# Altium project IOBoard2020.PrjPcb (part 2 of 3)

## Sheet Interlock.SchDoc
size A3
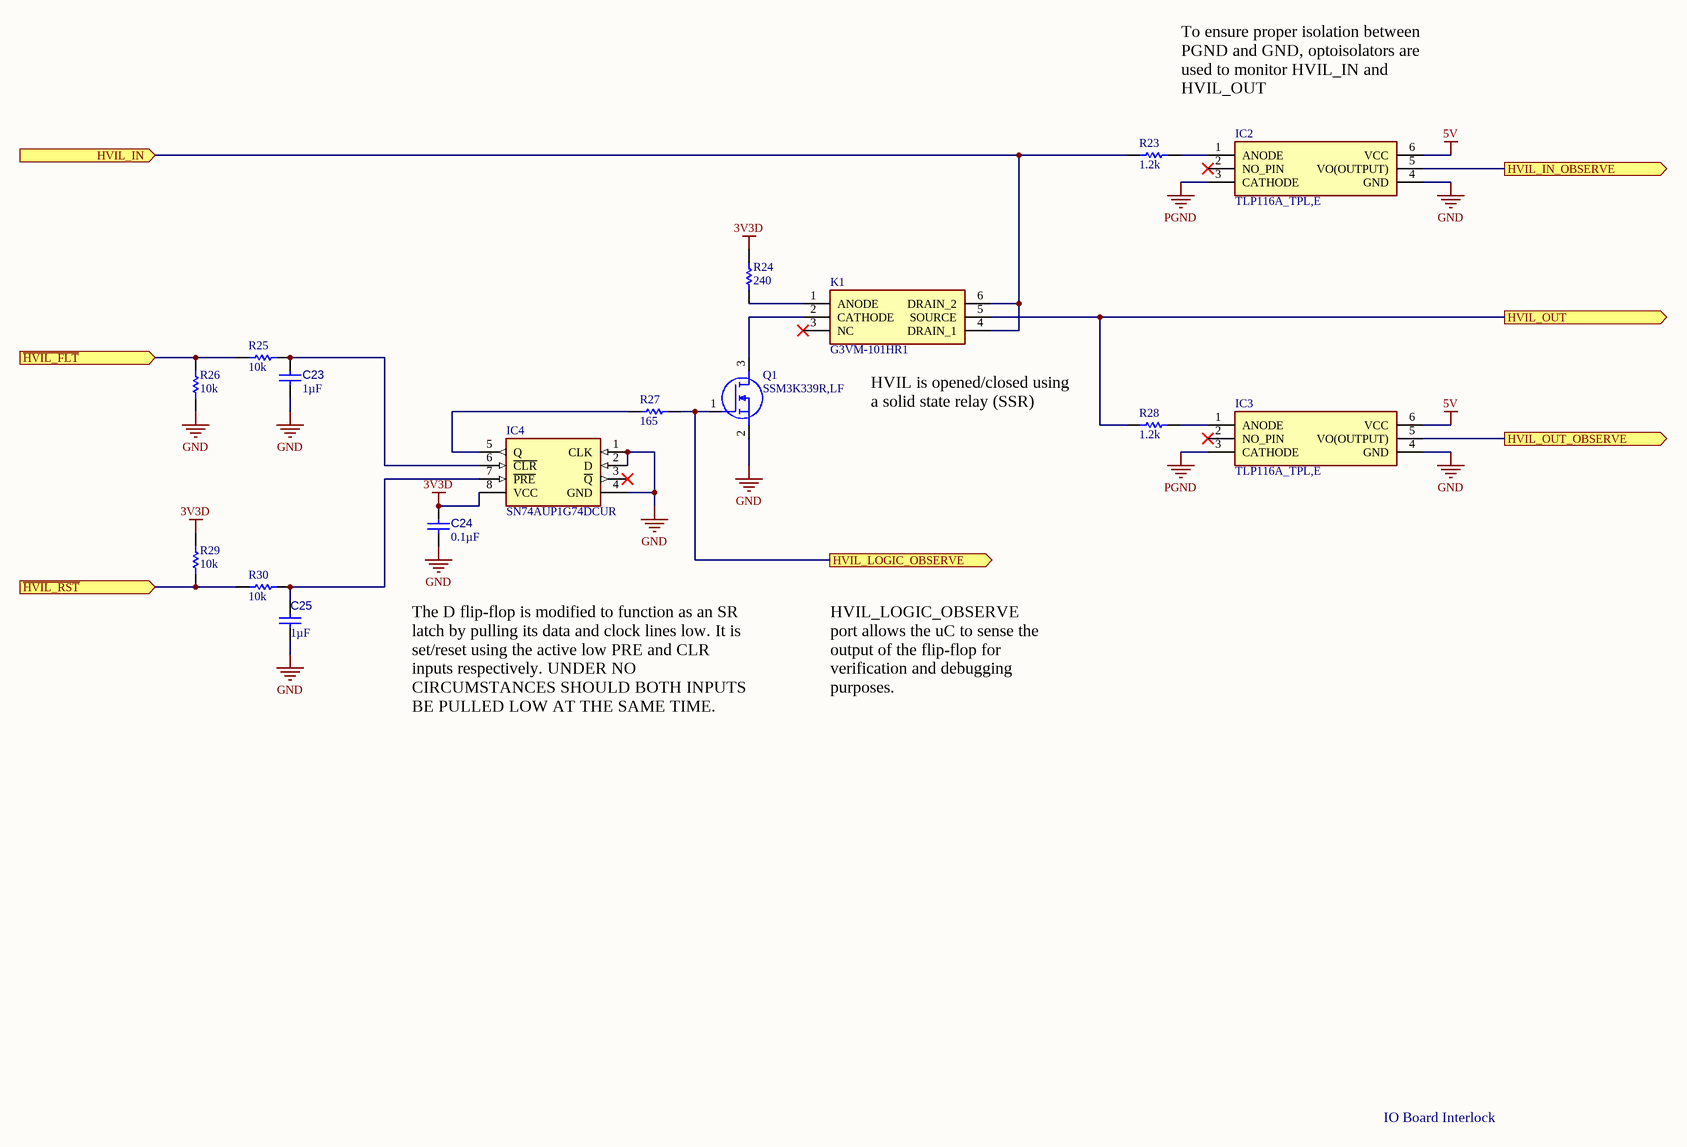
[diagram p3: Interlock.SchDoc]

### Parts
C23  1µF  [CAPC2013X145X50ML20T25]
C24  0.1µF  [CAPC2013X145X50ML20T25]
C25  1µF  [CAPC2013X145X50ML20T25]
IC2  TLP116A_TPL,E  [SOT127P700X230-6N]
IC3  TLP116A_TPL,E  [SOT127P700X230-6N]
IC4  SN74AUP1G74DCUR  [SOT50P310X90-8N]
K1  G3VM-101HR1  [G3VM101HR1]
Q1  SSM3K339R,LF  [SOTFL95P240X88-3N]
R23  1.2k  [RESC2013X50X35ML15T15]
R24  240  [RESC2013X50X35ML15T15]
R25  10k  [RESC2013X50X35ML15T15]
R26  10k  [RESC2013X50X35ML15T15]
R27  165  [RESC2013X50X35ML15T15]
R28  1.2k  [RESC2013X50X35ML15T15]
R29  10k  [RESC2013X50X35ML15T15]
R30  10k  [RESC2013X50X35ML15T15]

### Ports
HVIL_IN (in), HVIL_IN_OBSERVE (out), HVIL_LOGIC_OBSERVE (out), HVIL_OUT (out), HVIL_OUT_OBSERVE (out), ~{HVIL_FLT} (in), ~{HVIL_RST} (in)

### Nets
3V3D: C24.2 IC4.8(VCC) R24.1 R29.2
5V: IC2.6(VCC) IC3.6(VCC)
GND: C23.2 C24.1 C25.1 IC2.4(GND) IC3.4(GND) IC4.1(CLK) IC4.2(D) IC4.4(GND) Q1.2(S) R26.1
PGND: IC2.3(CATHODE) IC3.3(CATHODE)
NetC23_1: C23.1 IC4.6(~{CLR}) R25.1
NetC25_2: C25.2 IC4.7(~{PRE}) R30.1
NetIC1_92: Q1.1(G) R27.2 ; port HVIL_LOGIC_OBSERVE
NetIC1_93: IC2.5(VO(OUTPUT)) ; port HVIL_IN_OBSERVE
NetIC1_94: IC3.5(VO(OUTPUT)) ; port HVIL_OUT_OBSERVE
NetIC1_95: R25.2 R26.2 ; port ~{HVIL_FLT}
NetIC1_96: R29.1 R30.2 ; port ~{HVIL_RST}
NetIC2_1: IC2.1(ANODE) R23.2
NetIC3_1: IC3.1(ANODE) R28.2
NetIC4_5: IC4.5(Q) R27.1
NetJ5_1: K1.5(SOURCE) R28.1 ; port HVIL_OUT
NetJ5_2: K1.4(DRAIN_1) K1.6(DRAIN_2) R23.1 ; port HVIL_IN
NetK1_1: K1.1(ANODE) R24.2
NetK1_2: K1.2(CATHODE) Q1.3(D)

Not connected (* = marked no-connect by the designer): IC2 2(NO_PIN)*; IC3 2(NO_PIN)*; IC4 3(~{Q})*; K1 3(NC)*

### Notes on the sheet
- To ensure proper isolation between PGND and GND, optoisolators are used to monitor HVIL_IN and HVIL_OUT
- (near K1) HVIL is opened/closed using a solid state relay (SSR)
- The D flip-flop is modified to function as an SR latch by pulling its data and clock lines low. It is set/reset using the active low PRE and CLR inputs respectively. UNDER NO CIRCUMSTANCES SHOULD BOTH INPUTS BE PULLED LOW AT THE SAME TIME.
- HVIL_LOGIC_OBSERVE port allows the uC to sense the output of the flip-flop for verification and debugging purposes.
- IO Board Interlock

### Library data of the parts
C23 C25 = CMP-001-00010-4: Chip Capacitor, 1 uF, +/-10%, 25 V, 0805 (2012 Metric); Tolerance: 10%; Capacitor Type: Ceramic; Voltage Rating: 25V; Mounting Technology: SM; Case/Package: 0805; Max Operating Temperature: 125°C; RoHS Compliant: True; Value: 1µF; Min Operating Temperature: -55°C; Pins: 2
C24 = CMP-001-00010-4: Chip Capacitor, 0.1 uF, +/-10%, 25 V, 0805 (2012 Metric); Tolerance: 10%; Capacitor Type: Ceramic; Voltage Rating: 25V; Mounting Technology: SM; Case/Package: 0805; Max Operating Temperature: 125°C; RoHS Compliant: True; Value: 0.1µF; Min Operating Temperature: -55°C; Pins: 2
IC2 IC3 = TLP116A_TPL,E: Integrated Circuit; Manufacturer_Name: Toshiba; Manufacturer_Part_Number: TLP116A(TPL,E; Datasheet Link: https://media.digikey.com/pdf/Data%20Sheets/Toshiba%20PDFs/TLP116A.pdf; Height: 2.3mm; Arrow Part Number: TLP116A(TPL,E; Arrow Price/Stock: https://www.arrow.com/en/products/tlp116a-tple/toshiba; Mouser Part Number: 757-TLP116A(TPLE; Mouser Price/Stock: https://www.mouser.co.uk/ProductDetail/Toshiba/TLP116ATPLE?qs=HVbQlW5zcXWPuFTVF%252BZ0qw%3D%3D
IC4 = SN74AUP1G74DCUR: Integrated Circuit; Manufacturer_Name: Texas Instruments; Datasheet Link: http://www.ti.com/lit/gpn/sn74aup1g74; Height: 0.9mm; Manufacturer_Part_Number: SN74AUP1G74DCUR; Arrow Part Number: SN74AUP1G74DCUR; Arrow Price/Stock: https://www.arrow.com/en/products/sn74aup1g74dcur/texas-instruments; Mouser Part Number: 595-SN74AUP1G74DCUR; Mouser Price/Stock: https://www.mouser.co.uk/ProductDetail/Texas-Instruments/SN74AUP1G74DCUR?qs=7kv20MEVUlht0wF4P3v%252Bhg%3D%3D
K1 = G3VM-101HR1: Relay or Contactor; Manufacturer_Name: Omron Electronics; Datasheet Link: https://componentsearchengine.com/Datasheets/1/G3VM-101HR1.pdf; Height: 2.1mm; Manufacturer_Part_Number: G3VM-101HR1; Arrow Part Number: G3VM-101HR1; Arrow Price/Stock: https://www.arrow.com/en/products/g3vm-101hr1/omron; Mouser Part Number: 653-G3VM-101HR1; Mouser Price/Stock: https://www.mouser.com/Search/Refine.aspx?Keyword=653-G3VM-101HR1
Q1 = SSM3K339R,LF: MOSFET (N-Channel); Manufacturer_Name: Toshiba; Datasheet Link: https://www.arrow.com/en/products/ssm3k339rlf/toshiba; Height: 0.88mm; Manufacturer_Part_Number: SSM3K339R,LF; Arrow Part Number: SSM3K339R,LF; Arrow Price/Stock: https://www.arrow.com/en/products/ssm3k339rlf/toshiba; Mouser Part Number: 757-SSM3K339RLF; Mouser Price/Stock: https://www.mouser.co.uk/ProductDetail/Toshiba/SSM3K339RLF?qs=vPP9GyyTAo2h4IM%252B%252BLvR%252BA%3D%3D
R23 R26 R28 = CMP-009-00001-4: Chip Resistor, 1.2k Ohm, +/- 1%, 125 mW, -55 to 155 degC, 0805 (2012 Metric); Power: 125mW; Voltage Rating: 150V; Tolerance: 1%; Mounting Technology: SM; Min Operating Temperature: -55°C; Case/Package: 0805; Pins: 2; Max Operating Temperature: 155°C; RoHS Compliant: True
  R23 R28: Value: 1.2k
  R26: Value: 10k
R24 = CMP-009-00001-4: Chip Resistor, 240 Ohm, +/- 1%, 125 mW, -55 to 155 degC, 0805 (2012 Metric); Power: 125mW; Voltage Rating: 150V; Tolerance: 1%; Mounting Technology: SM; Value: 240; Min Operating Temperature: -55°C; Case/Package: 0805; Pins: 2; Max Operating Temperature: 155°C; RoHS Compliant: True
R25 R29 R30 = CMP-009-00001-4: Chip Resistor, 10k Ohm, +/- 1%, 125 mW, -55 to 155 degC, 0805 (2012 Metric); Power: 125mW; Voltage Rating: 150V; Tolerance: 1%; Mounting Technology: SM; Value: 10k; Min Operating Temperature: -55°C; Case/Package: 0805; Pins: 2; Max Operating Temperature: 155°C; RoHS Compliant: True
R27 = CMP-009-00001-4: Chip Resistor, 165 Ohm, +/- 1%, 125 mW, -55 to 155 degC, 0805 (2012 Metric); Power: 125mW; Voltage Rating: 150V; Tolerance: 1%; Mounting Technology: SM; Value: 165; Min Operating Temperature: -55°C; Case/Package: 0805; Pins: 2; Max Operating Temperature: 155°C; RoHS Compliant: True

## Sheet Sensors.SchDoc
size A3
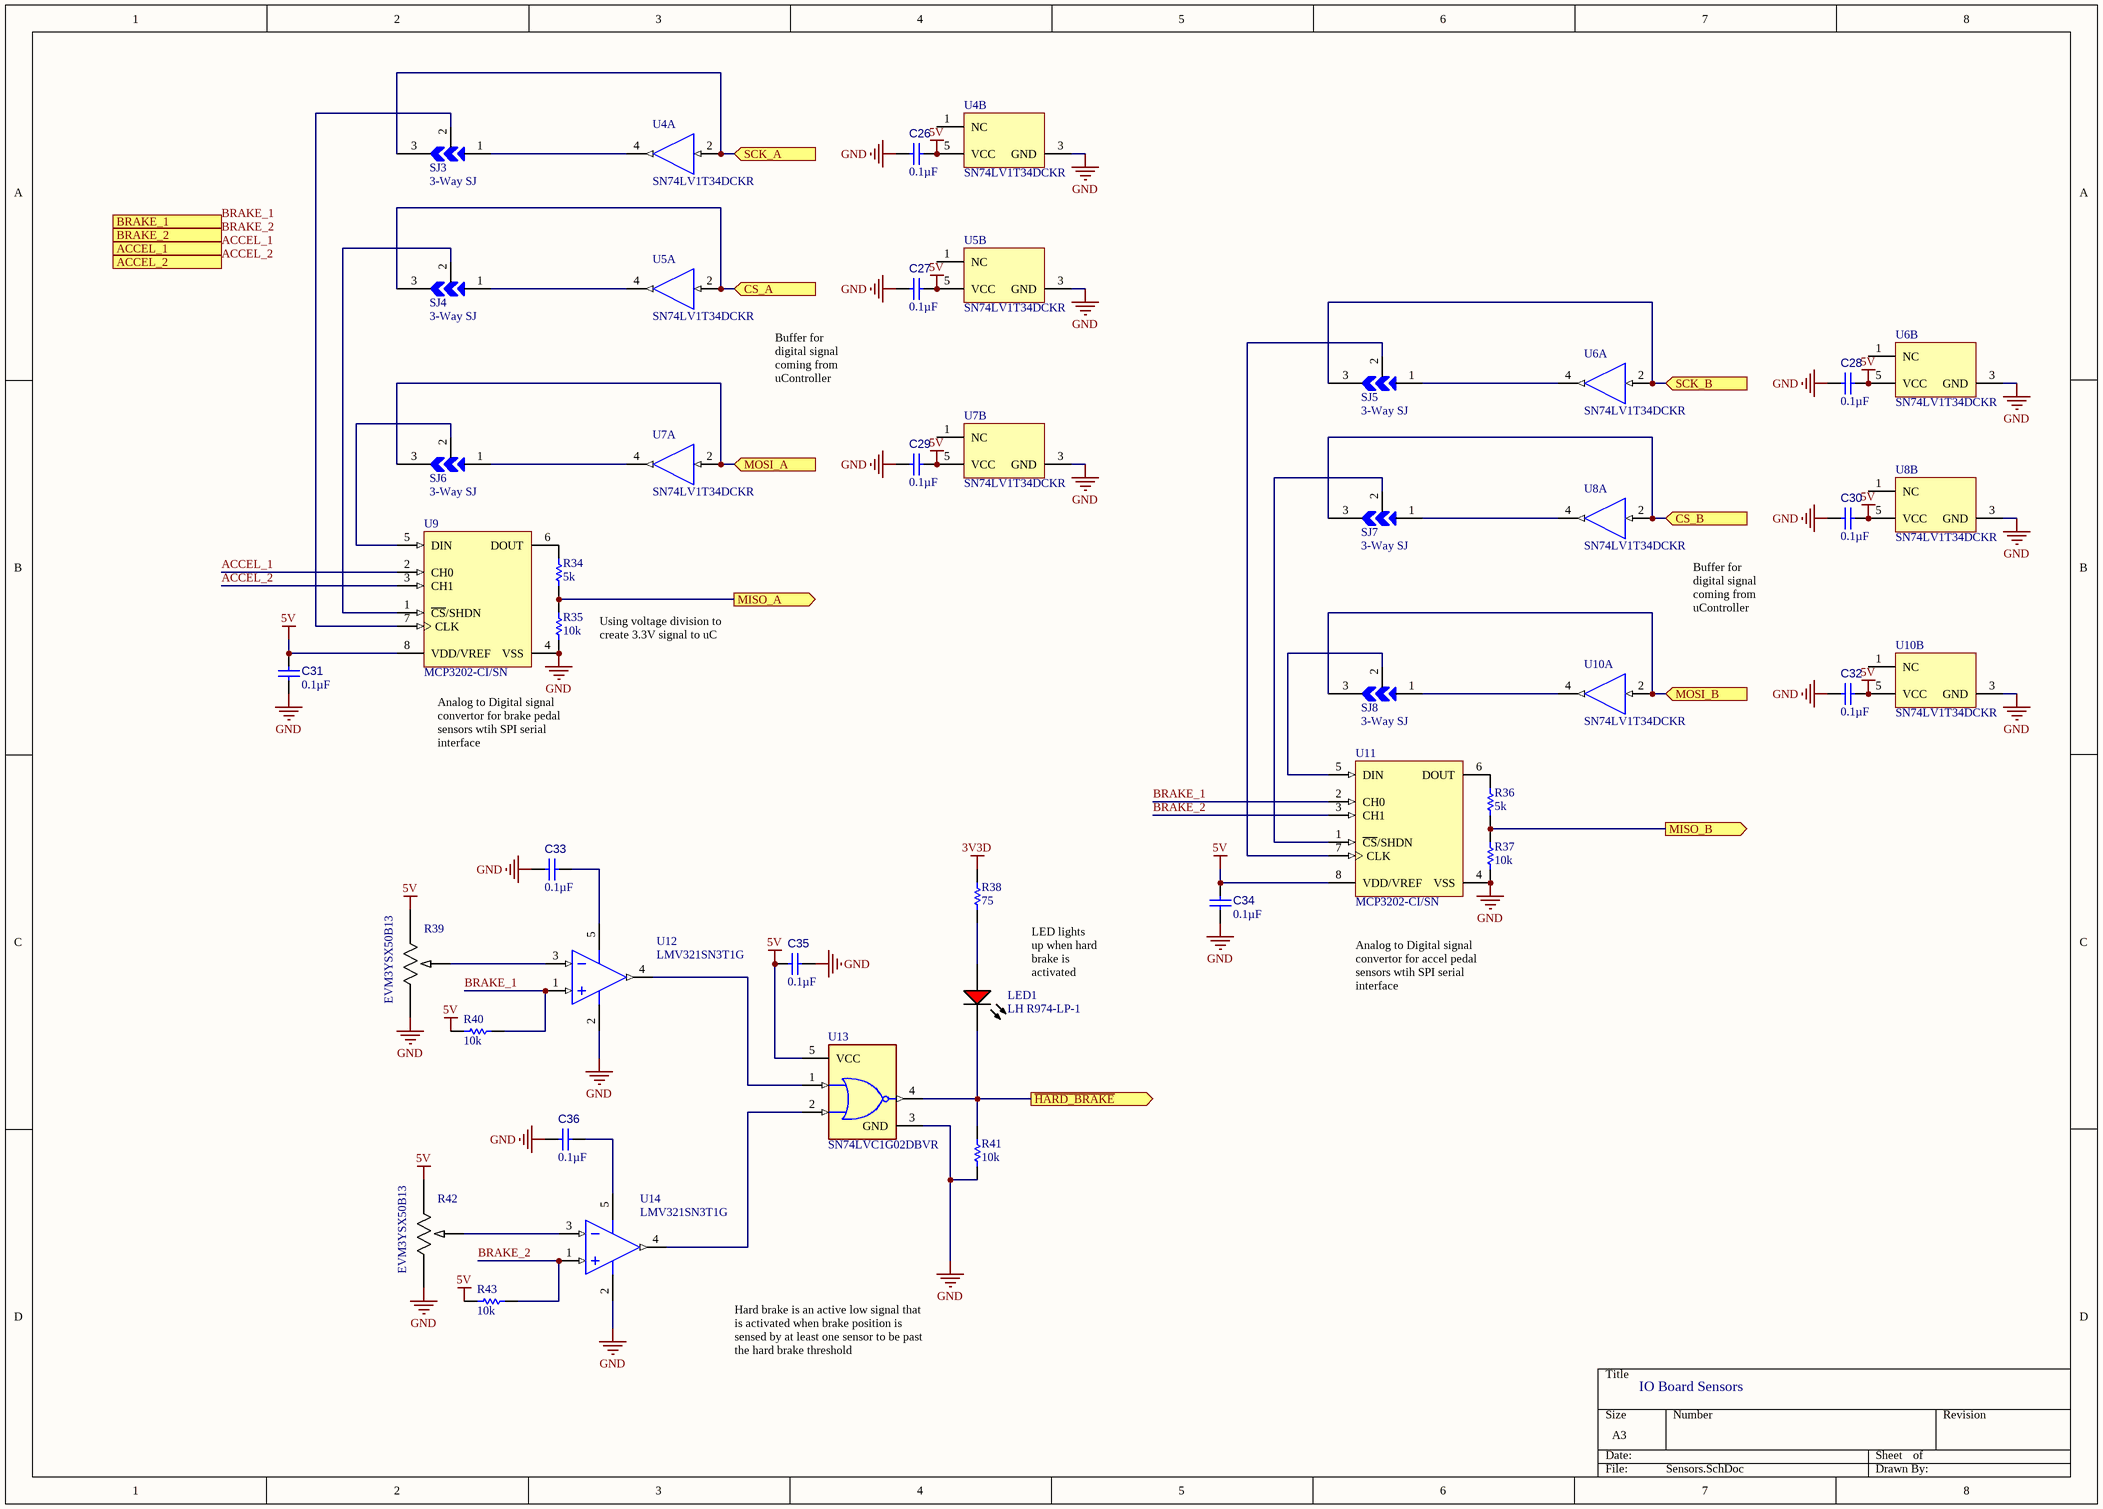
[diagram p4: Sensors.SchDoc]

### Parts
C26  0.1µF  [CAPC2013X145X50ML20T25]
C27  0.1µF  [CAPC2013X145X50ML20T25]
C28  0.1µF  [CAPC2013X145X50ML20T25]
C29  0.1µF  [CAPC2013X145X50ML20T25]
C30  0.1µF  [CAPC2013X145X50ML20T25]
C31  0.1µF  [CAPC2013X145X50ML20T25]
C32  0.1µF  [CAPC2013X145X50ML20T25]
C33  0.1µF  [CAPC2013X145X50ML20T25]
C34  0.1µF  [CAPC2013X145X50ML20T25]
C35  0.1µF  [CAPC2013X145X50ML20T25]
C36  0.1µF  [CAPC2013X145X50ML20T25]
LED1  LH R974-LP-1  [0805_A]
R34  5k  [RESC2013X50X35ML15T15]
R35  10k  [RESC2013X50X35ML15T15]
R36  5k  [RESC2013X50X35ML15T15]
R37  10k  [RESC2013X50X35ML15T15]
R38  75  [RESC2013X50X35ML15T15]
R39  EVM3YSX50B13  [POT_EVM3Y_PAN]
R40  10k  [RESC2013X50X35ML15T15]
R41  10k  [RESC2013X50X35ML15T15]
R42  EVM3YSX50B13  [POT_EVM3Y_PAN]
R43  10k  [RESC2013X50X35ML15T15]
SJ3  3-Way SJ  [3-Way SJ]
SJ4  3-Way SJ  [3-Way SJ]
SJ5  3-Way SJ  [3-Way SJ]
SJ6  3-Way SJ  [3-Way SJ]
SJ7  3-Way SJ  [3-Way SJ]
SJ8  3-Way SJ  [3-Way SJ]
U4  SN74LV1T34DCKR  [DCK0005A_L]  (parts A,B of 2)
U5  SN74LV1T34DCKR  [DCK0005A_L]  (parts A,B of 2)
U6  SN74LV1T34DCKR  [DCK0005A_L]  (parts A,B of 2)
U7  SN74LV1T34DCKR  [DCK0005A_L]  (parts A,B of 2)
U8  SN74LV1T34DCKR  [DCK0005A_L]  (parts A,B of 2)
U9  MCP3202-CI/SN  [SOIC-SN8_L]
U10  SN74LV1T34DCKR  [DCK0005A_L]  (parts A,B of 2)
U11  MCP3202-CI/SN  [SOIC-SN8_L]
U12  LMV321SN3T1G  [ONSC-TSOP-5-483-02_V]
U13  SN74LVC1G02DBVR  [FP-DBV0005A-MFG]
U14  LMV321SN3T1G  [ONSC-TSOP-5-483-02_V]

### Ports
ACCEL_1 (in), ACCEL_2 (in), BRAKE_1 (in), BRAKE_2 (in), CS_A (in), CS_B (in), MISO_A (out), MISO_B (out), MOSI_A (in), MOSI_B (in), SCK_A (in), SCK_B (in), ~{HARD_BRAKE} (out)

### Nets
3V3D: R38.1
5V: C26.1 C27.1 C28.1 C29.1 C30.1 C31.2 C32.1 C34.2 C35.2 R39.1 R40.2 R42.1 R43.2 U4.5(VCC) U5.5(VCC) U6.5(VCC) U7.5(VCC) U8.5(VCC) U9.8(VDD/VREF) U10.5(VCC) U11.8(VDD/VREF) U13.5(VCC)
GND: C26.2 C27.2 C28.2 C29.2 C30.2 C31.1 C32.2 C33.2 C34.1 C35.1 C36.2 R35.1 R37.1 R39.3 R41.1 R42.3 U4.3(GND) U5.3(GND) U6.3(GND) U7.3(GND) U8.3(GND) U9.4(VSS) U10.3(GND) U11.4(VSS) U12.2(V-) U13.3(GND) U14.2(V-)
ACCEL_1: U9.2(CH0) ; port ACCEL_1
ACCEL_2: U9.3(CH1) ; port ACCEL_2
BRAKE_1: R40.1 U11.2(CH0) U12.1(IN+) ; port BRAKE_1
BRAKE_2: R43.1 U11.3(CH1) U14.1(IN+) ; port BRAKE_2
NetC33_1: C33.1 U12.5(V+)
NetC36_1: C36.1 U14.5(V+)
NetIC1_26: SJ3.3 U4.2(A) ; port SCK_A
NetIC1_27: R34.2 R35.2 ; port MISO_A
NetIC1_28: SJ6.3 U7.2(A) ; port MOSI_A
NetIC1_29: SJ4.3 U5.2(A) ; port CS_A
NetIC1_47: SJ5.3 U6.2(A) ; port SCK_B
NetIC1_48: R36.2 R37.2 ; port MISO_B
NetIC1_49: SJ8.3 U10.2(A) ; port MOSI_B
NetIC1_50: SJ7.3 U8.2(A) ; port CS_B
NetIC1_72: LED1.1(K) R41.2 U13.4(Y) ; port ~{HARD_BRAKE}
NetLED1_2: LED1.2(A) R38.2
NetR34_1: R34.1 U9.6(DOUT)
NetR36_1: R36.1 U11.6(DOUT)
NetR39_2: R39.2 U12.3(IN-)
NetR42_2: R42.2 U14.3(IN-)
NetSJ3_1: SJ3.1 U4.4(Y)
NetSJ3_2: SJ3.2 U9.7(CLK)
NetSJ4_1: SJ4.1 U5.4(Y)
NetSJ4_2: SJ4.2 U9.1(~{CS}/SHDN)
NetSJ5_1: SJ5.1 U6.4(Y)
NetSJ5_2: SJ5.2 U11.7(CLK)
NetSJ6_1: SJ6.1 U7.4(Y)
NetSJ6_2: SJ6.2 U9.5(DIN)
NetSJ7_1: SJ7.1 U8.4(Y)
NetSJ7_2: SJ7.2 U11.1(~{CS}/SHDN)
NetSJ8_1: SJ8.1 U10.4(Y)
NetSJ8_2: SJ8.2 U11.5(DIN)
NetU12_4: U12.4(OUT) U13.1(A)
NetU13_2: U13.2(B) U14.4(OUT)

Not connected (* = marked no-connect by the designer): U4 1(NC); U5 1(NC); U6 1(NC); U7 1(NC); U8 1(NC); U10 1(NC)

### Notes on the sheet
- Buffer for digital signal coming from uController
- Using voltage division to create 3.3V signal to uC
- Analog to Digital signal convertor for brake pedal sensors wtih SPI serial interface
- LED lights up when hard brake is activated
- Analog to Digital signal convertor for accel pedal sensors wtih SPI serial interface
- Hard brake is an active low signal that is activated when brake position is sensed by at least one sensor to be past the hard brake threshold
- IO Board Sensors

### Library data of the parts
C26-C36 = CMP-001-00010-4: Chip Capacitor, 0.1 uF, +/-10%, 25 V, 0805 (2012 Metric); Manufacturer: KEMET; Manufacturer Part Number: C0805C104K3RACTU; Dielectric Material: Ceramic; Tolerance: 10%; Capacitance: 100nF; Dielectric: X7R; Voltage: 25V; Value: 0.1µF; Supplier 1: Digi-Key; Supplier Part Number 1: 399-1168-1-ND; RoHS: Yes; Category: Ceramic Capacitors; Stock 1: 417116; Pricing 1: 1=0.14000, 10=0.10000, 50=0.05660, 100=0.04680, 500=0.03284, 1000=0.02719 (USD); Mount: Surface Mount; Case/Package: 0805; Min Operating Temperature: -55°C; Max Operating Temperature: 125°C; Packaging: Tape and Reel; Termination: SMD/SMT; Length: 2mm; Height: 0.9mm; Depth: 1.25mm; Radiation Hardening: No; ComponentLink1URL: https://datasheet.ciiva.com/18193/getdatasheetpartid-385649-18193413.pdf?src-supplier=Verical; ComponentLink1Description: https://datasheet.ciiva.com/18193/getdatasheetpartid-385649-18193413.pdf?src-supplier=Verical; ComponentLink2URL: https://datasheet.ciiva.com/7842/kem-c1002-x7r-smd-7842536.pdf?src-supplier=Element14; ComponentLink2Description: https://datasheet.ciiva.com/7842/kem-c1002-x7r-smd-7842536.pdf?src-supplier=Element14; ComponentLink3URL: https://datasheet.ciiva.com/7842/kem-c1002-x7r-smd-7842538.pdf?src-supplier=Element14; ComponentLink3Description: https://datasheet.ciiva.com/7842/kem-c1002-x7r-smd-7842538.pdf?src-supplier=Element14
LED1 = CMP-62016-000032-1: LED RED DIFFUSED 0805 SMD; Number of Elements: 1; Forward Voltage: 2.6V; Viewing Angle: 160°; Reverse Voltage: 5V; Test Current: 20mA; Dominant Wavelength: 645nm; Forward Current: 30mA; Luminous Intensity: 15mcd; Depth: 1.35mm; Min Operating Temperature: -30°C; Length: 2.1mm; Max Operating Temperature: 85°C; Radiation Hardening: No; Packaging: Tape and Reel; Number of Pins: 2; Mount: Surface Mount; Lens Style: Diffused
R34 R36 = CMP-009-00001-4: Chip Resistor, 10k Ohm, +/- 1%, 125 mW, -55 to 155 degC, 0805 (2012 Metric); Manufacturer: Panasonic; Manufacturer Part Number: ERA-6AEB4991V; Resistance: 4.99kR; Tolerance: 0.1%; Temperature Coefficient: 25ppm/°C; Power Rating: 125mW; Voltage Rating: 200V; Voltage Rating (DC): 100V; Value: 5k; Supplier 1: Digi-Key; Supplier Part Number 1: P4.99KDACT-ND; RoHS: Yes; Category: Chip SMD Resistors; Stock 1: 19262; Pricing 1: 1=0.33000, 10=0.27800, 100=0.10850, 1000=0.04541, 2500=0.04163 (USD); Mount: Surface Mount; Case/Package: 0805; Number of Pins: 2; Weight: 0.000194oz; Contact Plating: Tin; Case Code (Metric): 2012; Case Code (Imperial): 0805; Min Operating Temperature: -55°C; Max Operating Temperature: 155°C; Resistor Type: Thin Film,Metal Film; Packaging: Tape and Reel; Package Quantity: 1; Number of Terminations: 2; Termination: SMD/SMT; Max Power Dissipation: 125mW; Features: Automotive AEC-Q200; Length: 2mm; Height: 0.5mm; Width: 1.25mm; Depth: 1.25mm; Radiation Hardening: No; REACH SVHC: No SVHC; Military Standard: Not; Lead Free: Lead Free; ComponentLink1URL: https://datasheet.ciiva.com/11811/0900766b80eb1d8c-11811290.pdf?src-supplier=RSComponents; ComponentLink1Description: https://datasheet.ciiva.com/11811/0900766b80eb1d8c-11811290.pdf?src-supplier=RSComponents; ComponentLink2URL: https://datasheet.ciiva.com/26335/459226-da-01-en-widerstand-0805-era-26335808.pdf?src-supplier=Conrad; ComponentLink2Description: https://datasheet.ciiva.com/26335/459226-da-01-en-widerstand-0805-era-26335808.pdf?src-supplier=Conrad; ComponentLink3URL: https://datasheet.ciiva.com/43457/485442-43457400.pdf?src-supplier=Farnell; ComponentLink3Description: https://datasheet.ciiva.com/43457/485442-43457400.pdf?src-supplier=Farnell; ComponentLink4URL: https://datasheet.ciiva.com/24124/aoa0000ce26-197354-24124201.pdf?src-supplier=Mouser; ComponentLink4Description: https://datasheet.ciiva.com/24124/aoa0000ce26-197354-24124201.pdf?src-supplier=Mouser; ComponentLink5URL: https://datasheet.ciiva.com/6064/485442-6064426.pdf?src-supplier=Farnell; ComponentLink5Description: https://datasheet.ciiva.com/6064/485442-6064426.pdf?src-supplier=Farnell; ComponentLink6URL: https://datasheet.ciiva.com/6064/485442-6064427.pdf?src-supplier=Farnell; ComponentLink6Description: https://datasheet.ciiva.com/6064/485442-6064427.pdf?src-supplier=Farnell; ComponentLink7URL: https://datasheet.ciiva.com/17213/aoa0000ce26-17213069.pdf?src-supplier=Avnet+Europe; ComponentLink7Description: https://datasheet.ciiva.com/17213/aoa0000ce26-17213069.pdf?src-supplier=Avnet+Europe; ComponentLink8URL: https://datasheet.ciiva.com/46388/485442-46388221.pdf?src-supplier=Element14; ComponentLink8Description: https://datasheet.ciiva.com/46388/485442-46388221.pdf?src-supplier=Element14; ComponentLink9URL: https://datasheet.ciiva.com/22740/1776116-22740207.pdf?src-supplier=Element14; ComponentLink9Description: https://datasheet.ciiva.com/22740/1776116-22740207.pdf?src-supplier=Element14; ComponentLink10URL: https://datasheet.ciiva.com/46376/485442-46376911.pdf?src-supplier=Element14; ComponentLink10Description: https://datasheet.ciiva.com/46376/485442-46376911.pdf?src-supplier=Element14
R35 R37 R40 R41 R43 = CMP-009-00001-4: Chip Resistor, 10k Ohm, +/- 1%, 125 mW, -55 to 155 degC, 0805 (2012 Metric); Manufacturer: Yageo; Manufacturer Part Number: RC0805FR-0710KL; Resistance: 10kR; Temperature Coefficient: 100ppm/°C; Power Rating: 125mW; Voltage Rating: 150V; Value: 10k; Supplier 1: Digi-Key; Supplier Part Number 1: 311-10.0KCRCT-ND; RoHS: Yes; Category: Chip SMD Resistors; Stock 1: 19063106; Pricing 1: 1=0.10000, 10=0.03900, 100=0.01570, 1000=0.00705, 2500=0.00612 (USD); Case/Package: 0805; Case Code (Imperial): 0805; Case Code (Metric): 2012; Min Operating Temperature: -55°C; Max Operating Temperature: 155°C; Packaging: Tape and Reel; Tolerance: 1%; Composition: Thick Film; Package Quantity: 1; Termination: SMD/SMT; Number of Terminations: 2; Military Standard: Not; Max Power Dissipation: 125mW; Features: Moisture Resistant; Length: 2mm; Height: 0.024inch; Width: 0.049inch; Depth: 1.25mm; REACH SVHC: Unknown; Lead Free: Lead Free; ComponentLink1URL: https://datasheet.ciiva.com/11808/0900766b8106beab-11808151.pdf?src-supplier=RSComponents; ComponentLink1Description: https://datasheet.ciiva.com/11808/0900766b8106beab-11808151.pdf?src-supplier=RSComponents; ComponentLink2URL: https://datasheet.ciiva.com/12669/rc0805-12669688.pdf?src-supplier=Mouser; ComponentLink2Description: https://datasheet.ciiva.com/12669/rc0805-12669688.pdf?src-supplier=Mouser; ComponentLink3URL: https://datasheet.ciiva.com/46447/444164-46447563.pdf?src-supplier=Element14; ComponentLink3Description: https://datasheet.ciiva.com/46447/444164-46447563.pdf?src-supplier=Element14; ComponentLink4URL: https://datasheet.ciiva.com/2456/pyu-r-int-thick-7-2456972.pdf?src-supplier=Digi-Key; ComponentLink4Description: https://datasheet.ciiva.com/2456/pyu-r-int-thick-7-2456972.pdf?src-supplier=Digi-Key; ComponentLink5URL: https://datasheet.ciiva.com/2456/pyu-r-int-thick-7-2456973.pdf?src-supplier=Digi-Key; ComponentLink5Description: https://datasheet.ciiva.com/2456/pyu-r-int-thick-7-2456973.pdf?src-supplier=Digi-Key; ComponentLink6URL: https://datasheet.ciiva.com/2456/pyu-r-int-thick-7-2456974.pdf?src-supplier=Digi-Key; ComponentLink6Description: https://datasheet.ciiva.com/2456/pyu-r-int-thick-7-2456974.pdf?src-supplier=Digi-Key; ComponentLink7URL: https://datasheet.ciiva.com/16747/rc0805-16747087.pdf?src-supplier=Future+Electronics; ComponentLink7Description: https://datasheet.ciiva.com/16747/rc0805-16747087.pdf?src-supplier=Future+Electronics
R38 = CMP-009-00001-4: Chip Resistor, 10k Ohm, +/- 1%, 125 mW, -55 to 155 degC, 0805 (2012 Metric); Manufacturer: Panasonic; Manufacturer Part Number: ERA-6AEB750V; Resistance: 75R; Tolerance: 0.1%; Temperature Coefficient: 25ppm/°C; Power Rating: 125mW; Voltage Rating: 100V; Value: 75; Supplier 1: Digi-Key; Supplier Part Number 1: P75DACT-ND; RoHS: Yes; Category: Chip SMD Resistors; Stock 1: 28395; Pricing 1: 1=0.33000, 10=0.27800, 100=0.10850, 1000=0.04541, 2500=0.04163 (USD); Mount: Surface Mount; Case/Package: 0805; Number of Pins: 2; Contact Plating: Tin; Case Code (Metric): 2012; Case Code (Imperial): 0805; Min Operating Temperature: -55°C; Max Operating Temperature: 155°C; Resistor Type: Thin Film; Packaging: Tape and Reel; Package Quantity: 5000; Number of Terminations: 2; Termination: SMD/SMT; Max Power Dissipation: 125mW; Voltage Rating (DC): 100V; Length: 2mm; Height: 0.024inch; Width: 0.049inch; Depth: 1.25mm; Radiation Hardening: No; REACH SVHC: Yes; Military Standard: Not; Lead Free: Lead Free; ComponentLink1URL: https://datasheet.ciiva.com/29184/452659-da-01-en-widerstand-0805-era-29184043.pdf?src-supplier=Conrad; ComponentLink1Description: https://datasheet.ciiva.com/29184/452659-da-01-en-widerstand-0805-era-29184043.pdf?src-supplier=Conrad; ComponentLink2URL: https://datasheet.ciiva.com/5917/485442-5917734.pdf?src-supplier=Farnell; ComponentLink2Description: https://datasheet.ciiva.com/5917/485442-5917734.pdf?src-supplier=Farnell; ComponentLink3URL: https://datasheet.ciiva.com/48536/era-eng-tds-48536758.pdf?src-supplier=Distrelec; ComponentLink3Description: https://datasheet.ciiva.com/48536/era-eng-tds-48536758.pdf?src-supplier=Distrelec; ComponentLink4URL: https://datasheet.ciiva.com/5917/485442-5917735.pdf?src-supplier=Farnell; ComponentLink4Description: https://datasheet.ciiva.com/5917/485442-5917735.pdf?src-supplier=Farnell; ComponentLink5URL: https://datasheet.ciiva.com/5917/485442-5917736.pdf?src-supplier=Farnell; ComponentLink5Description: https://datasheet.ciiva.com/5917/485442-5917736.pdf?src-supplier=Farnell; ComponentLink6URL: https://datasheet.ciiva.com/7710/485442-7710664.pdf?src-supplier=Element14; ComponentLink6Description: https://datasheet.ciiva.com/7710/485442-7710664.pdf?src-supplier=Element14; ComponentLink7URL: https://datasheet.ciiva.com/7710/485442-7710665.pdf?src-supplier=Element14; ComponentLink7Description: https://datasheet.ciiva.com/7710/485442-7710665.pdf?src-supplier=Element14; ComponentLink8URL: https://datasheet.ciiva.com/17208/aoa0000ce26-17208633.pdf?src-supplier=Avnet+Europe; ComponentLink8Description: https://datasheet.ciiva.com/17208/aoa0000ce26-17208633.pdf?src-supplier=Avnet+Europe; ComponentLink9URL: https://datasheet.ciiva.com/9187/aoa0000ce26-9187722.pdf?src-supplier=Avnet; ComponentLink9Description: https://datasheet.ciiva.com/9187/aoa0000ce26-9187722.pdf?src-supplier=Avnet; ComponentLink10URL: https://datasheet.ciiva.com/48425/era-eng-tds-48425627.pdf?src-supplier=Distrelec; ComponentLink10Description: https://datasheet.ciiva.com/48425/era-eng-tds-48425627.pdf?src-supplier=Distrelec; ComponentLink11URL: https://datasheet.ciiva.com/30147/54aoa0000ce26-30147167.pdf?src-supplier=Onlinecomponents.com; ComponentLink11Description: https://datasheet.ciiva.com/30147/54aoa0000ce26-30147167.pdf?src-supplier=Onlinecomponents.com
R39 R42 = EVM3YSX50B13: Panasonic EVM-3YSX50B13; Built_By: EMA_UL_Team; SourceLibrary: Panasonic_2012-04-02a; Vendor: Panasonic; Manufacturer_Part_Number: EVM3YSX50B13; Copyright: Copyright (C) 2018 Accelerated Designs. All rights reserved; RefDes: RefDes; Type: DEV
SJ3-SJ8 = 3-Way SJ: 3-Way Solder Jumper
U4-U8 U10 = CMP-0859-00371-3: Single Power Supply BUFFER Logic Level Shifter (no enable), DCK0005A, LARGE T&R; Manufacturer: Texas Instruments; 3-State Output: Yes; Sub-Family: Non-Inverting Buffer/Driver; Rating: Catalog; ICC @ Nom Voltage(Max)(mA): 0.01; Logic: True; tpd @ Nom Voltage(Max)(ns): 14.5,9.5,8.0,6.5; Output Type: CMOS; VCC(Max)(V): 5.5; Voltage(Nom)(V): 1.8,2.5,3.3,5.5; Bits(#): 1; Output Drive (IOL/IOH)(Max)(mA): 8/-8; F @ Nom Voltage(Max)(Mhz): 50; Special Features: 1.8V to 3.3V Up Translation,3.3V to 1.8V Down Translation,5V Input Tolerant; Input Type: TTL; Technology Family: LV1T; VCC(Min)(V): 1.6; Operating Temperature Range(C): -40 to 125; DatasheetVersion: SCLS743A; Generic Part Number: SN74LV1T34; PackageReference: DCK0005A; Schmitt Trigger: No
U9 U11 = CMP-0188-00474-2: 2.7V Dual Channel 12-Bit A/D Converter with SPI Serial Interface, 8-Pin SOIC 150mil, C Performance Grade, Industrial Temperature; ComponentLink2URL: http://ww1.microchip.com/downloads/en/DeviceDoc/21034F.pdf; DatasheetVersion: revF, Nov-2011; ComponentLink1URL: http://www.microchip.com/; PackageDescription: 8-Lead Plastic Small Outline (SN) - Narrow, 3.90mm Body [SOIC]; ComponentLink3Description: Package Specification; PackageReference: SOIC-SN8; ComponentLink2Description: Datasheet; Code_JEDEC: MS-012; Code_IPC: SOIC127P600-8; PackageVersion: revBB, Aug-2009; ComponentLink3URL: http://www.microchip.com/stellent/groups/techpub_sg/documents/packagingspec/en012702.pdf; RevisionNote: URLs added. DatasheetVersion updated.; ComponentLink1Description: Manufacturer URL
U12 U14 = CMP-1310-00382-1: Single Low-Voltage, Rail-to-Rail Operational Amplifier, 2.7 to 5.5 V, -40 to 85 degC, 5-Pin TSOP, Pb-Free, Tape and Reel; Manufacturer: On Semiconductor; SR Typ (V/uS): 1; VCC Min (V): 2.7; VCC Max (V): 5.5; DatasheetVersion: Rev. 10; ComponentLink3Description: Package Specification; PackageDescription: 5-Pin Small Outline Package, Body 3 x 1.5 mm, Pitch 0.95 mm; ComponentLink1Description: Manufacturer URL; ComponentLink2URL: http://www.onsemi.cn/pub_link/Collateral/LMV321-LMV358-LMV324-D.PDF; GBW Typ (MHz): 1; ComponentLink3URL: http://www.onsemi.com/pub_link/Collateral/483.PDF; RoHS: TRUE; Packing: Tape and Reel; ComponentLink2Description: Datasheet; PackageReference: TSOP-5-483-02; ComponentLink1URL: http://www.onsemi.com/; PackageVersion: Rev. K, 04/2013; Mounting Technology: Surface Mount; PartNumber: LMV321SN3T1G
U13 = CMP-04903-000054-1: IC GATE NOR 1CH 2-INP SOT23-5; Manufacturer: Texas Instruments; Nominal Supply Current: 10uA; Frequency: 100MHz; Propagation Delay: 4.5ns; Number Of Circuits: 1; Max Supply Voltage: 5.5V; Min Supply Voltage: 1.65V; Standoff Height: 0mm; Number Of Inputs: 2; Manufacturer Part Number: SN74LVC1G02DBVR; Logic Function Desc: NOR; Ambient Temperature Range High: +125°C; Height: 1.45mm; RoHS: TRUE; ComponentLink2Description: Datasheet; Automotive: No; Device Class L2: Logic ICs; Temperature: -40°C to +125°C; Ambient Temperature Range Low: -40°C; Temperature Range Low: -40°C; Device Class L1: Integrated Circuits (ICs); Lead Free: Yes; Mouser Description: Logic Gates Single 2-Input Pos- NOR Gate; Category: IC; Number Of Outputs: 1; Digikey Description: IC GATE NOR 1CH 2-INP SOT23-5; Device Class L3: Logic Gates; Octopart: https://octopart.com/sn74lvc1g02dbvr-texas+instruments-464409; ComponentLink2URL: http://www.ti.com/lit/ds/symlink/sn74lvc1g02.pdf; Package: DBV0005A; Ipc Land Pattern Name: SOT95P280X145-5; Temperature Range High: +125°C

## Sheet Power.SchDoc
size A3
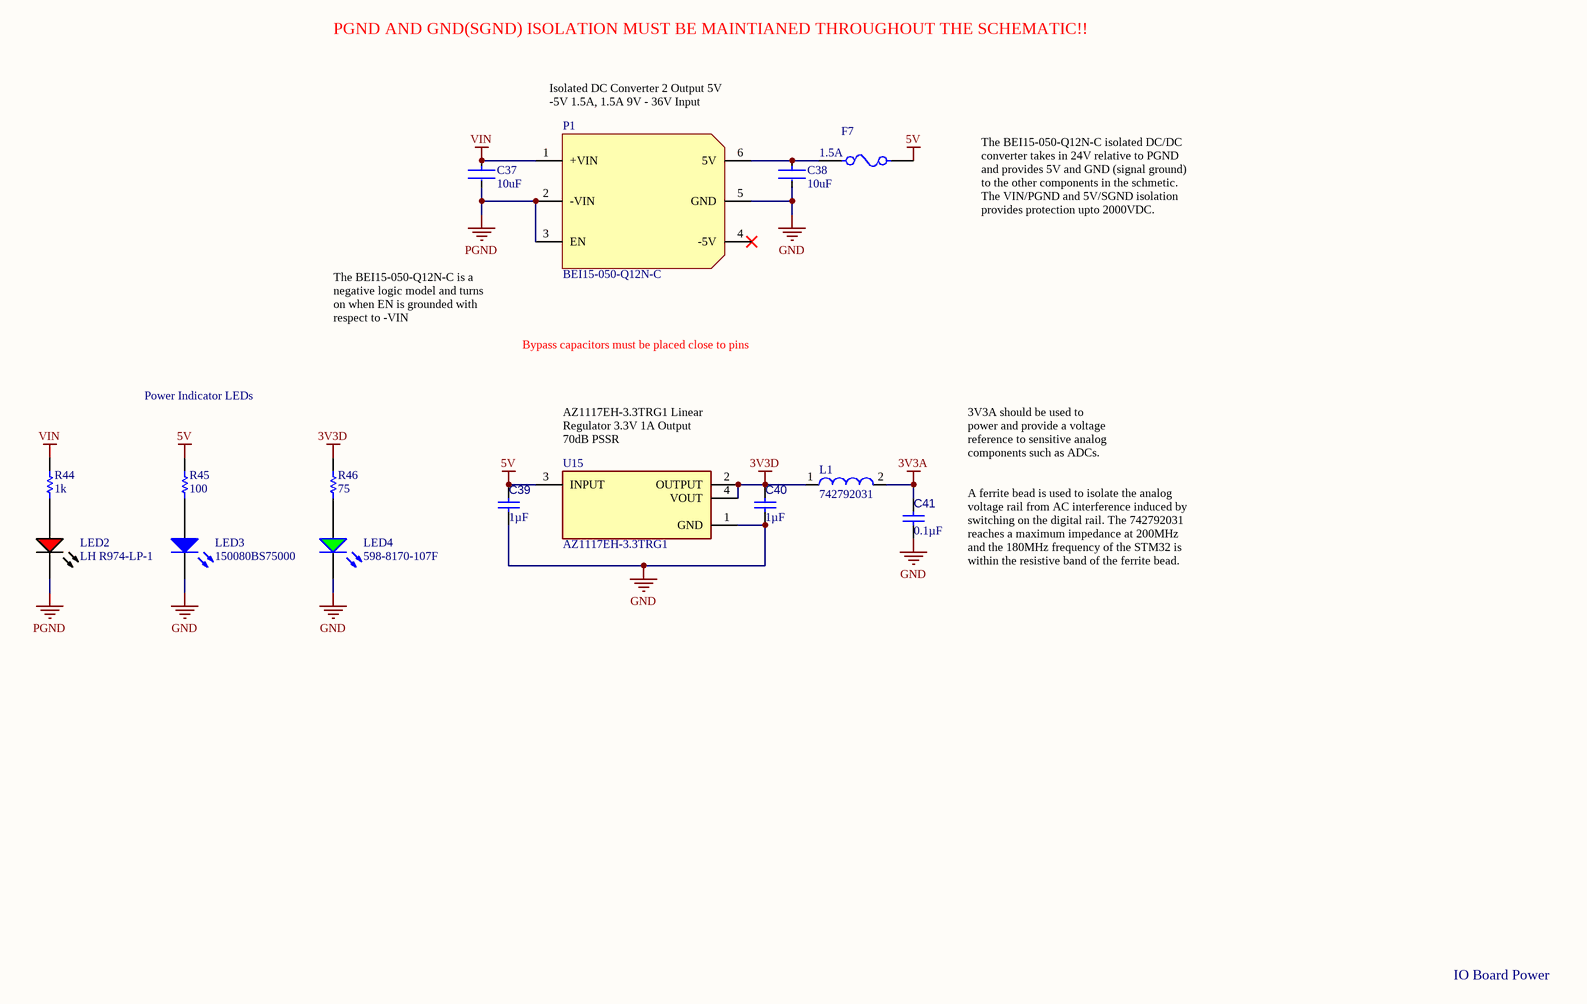
[diagram p5: Power.SchDoc]

### Parts
C37  10uF  [FP-CL32-IPC_C]
C38  10uF  [FP-CL32-IPC_C]
C39  1µF  [CAPC2013X145X50ML20T25]
C40  1µF  [CAPC2013X145X50ML20T25]
C41  0.1µF  [CAPC2013X145X50ML20T25]
F7  1.5A  [FUSC1608X43N]
L1  742792031  [SMD-0805]
LED2  LH R974-LP-1  [0805_A]
LED3  150080BS75000  [0805_A]
LED4  598-8170-107F  [0805_A]
P1  BEI15-050-Q12N-C  [BEI15-050-Q12N-C]
R44  1k  [RESC2013X50X35ML15T15]
R45  100  [RESC2013X50X35ML15T15]
R46  75  [RESC2013X50X35ML15T15]
U15  AZ1117EH-3.3TRG1  [FP-SOT223-MFG]

### Nets
3V3A: C41.1 L1.2
3V3D: C40.2 L1.1 R46.1 U15.2(OUTPUT) U15.4(VOUT)
5V: C39.2 F7.2 R45.2 U15.3(INPUT)
GND: C38.2 C39.1 C40.1 C41.2 LED3.1(K) LED4.1(K) P1.5(GND) U15.1(GND)
PGND: C37.2 LED2.1(K) P1.2(-VIN) P1.3(EN)
VIN: C37.1 P1.1(+VIN) R44.1
NetC38_1: C38.1 F7.1 P1.6(5V)
NetLED2_2: LED2.2(A) R44.2
NetLED3_2: LED3.2(A) R45.1
NetLED4_2: LED4.2(A) R46.2

Not connected (* = marked no-connect by the designer): P1 4(-5V)*

### Notes on the sheet
- PGND AND GND(SGND) ISOLATION MUST BE MAINTIANED THROUGHOUT THE SCHEMATIC!!
- Isolated DC Converter 2 Output 5V -5V 1.5A, 1.5A 9V - 36V Input
- The BEI15-050-Q12N-C isolated DC/DC converter takes in 24V relative to PGND and provides 5V and GND (signal ground) to the other components in the schmetic. The VIN/PGND and 5V/SGND isolation provides protection upto 2000VDC.
- The BEI15-050-Q12N-C is a negative logic model and turns on when EN is grounded with respect to -VIN
- Bypass capacitors must be placed close to pins
- Power Indicator LEDs
- (near U15) AZ1117EH-3.3TRG1 Linear Regulator 3.3V 1A Output 70dB PSSR
- 3V3A should be used to power and provide a voltage reference to sensitive analog components such as ADCs.
- A ferrite bead is used to isolate the analog voltage rail from AC interference induced by switching on the digital rail. The 742792031 reaches a maximum impedance at 200MHz and the 180MHz frequency of the STM32 is within the resistive band of the ferrite bead.
- IO Board Power

### Library data of the parts
C37 C38 = CMP-13271-000075-1: Cap Ceramic 10uF 35V Y5V -20/+80% SMD 1210 +85°C Embossed T/R; Manufacturer: Murata; Manufacturer Part Number: GRM32ER71H106KA12L; Tolerance: 10%; Voltage Rating: 50V; Dielectric: X7R; Value: 10uF; Supplier 1: Digi-Key; Supplier Part Number 1: 490-6544-1-ND; RoHS: Yes; Category: Ceramic Capacitors; Stock 1: 152438; Pricing 1: 1=1.31000, 10=1.03400, 50=0.89600, 100=0.77540, 500=0.58584 (USD); Mount: Surface Mount; Case/Package: 1210; Case Code (Imperial): 1210; Case Code (Metric): 3225; Material: Ceramic; Min Operating Temperature: -55°C; Max Operating Temperature: 125°C; Capacitance: 10uF; Package Quantity: 1000; Packaging: Tape and Reel; Voltage Rating (DC): 50V; Termination: SMD/SMT; Voltage: 50V; Length: 3.2mm; Height: 2.5mm; Width: 2.5mm; Thickness: 0.106inch; Depth: 2.5mm; Radiation Hardening: No; REACH SVHC: No SVHC; Lead Free: Lead Free; ComponentLink1URL: https://datasheet.ciiva.com/16497/product-16497010.pdf?src-supplier=Future+Electronics; ComponentLink1Description: https://datasheet.ciiva.com/16497/product-16497010.pdf?src-supplier=Future+Electronics; ComponentLink2URL: https://datasheet.ciiva.com/11789/0900766b80ef921d-11789081.pdf?src-supplier=RSComponents; ComponentLink2Description: https://datasheet.ciiva.com/11789/0900766b80ef921d-11789081.pdf?src-supplier=RSComponents; ComponentLink3URL: https://datasheet.ciiva.com/3777/4286grm32er71h106ka1223-3777306.pdf?src-supplier=Arrow+Electronics; ComponentLink3Description: https://datasheet.ciiva.com/3777/4286grm32er71h106ka1223-3777306.pdf?src-supplier=Arrow+Electronics; ComponentLink4URL: https://datasheet.ciiva.com/6270/partnumbering-e-01-6270167.pdf?src-supplier=Digi-Key; ComponentLink4Description: https://datasheet.ciiva.com/6270/partnumbering-e-01-6270167.pdf?src-supplier=Digi-Key; ComponentLink5URL: https://datasheet.ciiva.com/6270/partnumbering-e-01-6270168.pdf?src-supplier=Digi-Key; ComponentLink5Description: https://datasheet.ciiva.com/6270/partnumbering-e-01-6270168.pdf?src-supplier=Digi-Key; ComponentLink6URL: https://datasheet.ciiva.com/6270/partnumbering-e-01-6270169.pdf?src-supplier=Digi-Key; ComponentLink6Description: https://datasheet.ciiva.com/6270/partnumbering-e-01-6270169.pdf?src-supplier=Digi-Key; ComponentLink7URL: https://datasheet.ciiva.com/11607/c02e-11607596.pdf?src-supplier=Avnet; ComponentLink7Description: https://datasheet.ciiva.com/11607/c02e-11607596.pdf?src-supplier=Avnet; ComponentLink8URL: https://datasheet.ciiva.com/46441/1754714-46441340.pdf?src-supplier=Element14; ComponentLink8Description: https://datasheet.ciiva.com/46441/1754714-46441340.pdf?src-supplier=Element14
C39 C40 = CMP-001-00010-4: Chip Capacitor, 1 uF, +/-10%, 25 V, 0805 (2012 Metric); Manufacturer: KEMET; Manufacturer Part Number: C0805C105K3RACTU; Dielectric Material: Ceramic; Capacitance: 1uF; Tolerance: 10%; Dielectric: X7R; Voltage: 25V; Value: 1µF; Supplier 1: Digi-Key; Supplier Part Number 1: 399-8004-1-ND; RoHS: Yes; Category: Ceramic Capacitors; Stock 1: 360844; Pricing 1: 1=0.14000, 10=0.10100, 50=0.05720, 100=0.04740, 500=0.03322, 1000=0.02750 (USD); Mount: Surface Mount; Case/Package: 0805; Number of Pins: 2; Contact Plating: Tin,Matte; Case Code (Imperial): 0805; Case Code (Metric): 2012; Min Operating Temperature: -55°C; Max Operating Temperature: 125°C; Packaging: Tape and Reel; Termination: SMD/SMT; Package Quantity: 1; Voltage Rating: 25V; Voltage Rating (DC): 25V; Length: 2mm; Height: 1.25mm; Depth: 1.25mm; Width: 0.049inch; Thickness: 0.055inch; Radiation Hardening: No; REACH SVHC: No SVHC; ComponentLink1URL: https://datasheet.ciiva.com/6074/kem-c1002-x7r-smd-6074661.pdf?src-supplier=Farnell; ComponentLink1Description: https://datasheet.ciiva.com/6074/kem-c1002-x7r-smd-6074661.pdf?src-supplier=Farnell; ComponentLink2URL: https://datasheet.ciiva.com/28610/1918693-28610874.pdf?src-supplier=Element14; ComponentLink2Description: https://datasheet.ciiva.com/28610/1918693-28610874.pdf?src-supplier=Element14
C41 = CMP-001-00010-4: as C26 on sheet Sensors; Value: 0.1µF; Supplier 1: Digi-Key; Supplier Part Number 1: 399-1168-1-ND; RoHS: Yes; Category: Ceramic Capacitors; Stock 1: 417116; Pricing 1: 1=0.14000, 10=0.10000, 50=0.05660, 100=0.04680, 500=0.03284, 1000=0.02719 (USD); Mount: Surface Mount; Case/Package: 0805; Min Operating Temperature: -55°C; Max Operating Temperature: 125°C; Packaging: Tape and Reel; Termination: SMD/SMT; Length: 2mm; Height: 0.9mm; Depth: 1.25mm; Radiation Hardening: No; ComponentLink1URL: https://datasheet.ciiva.com/18193/getdatasheetpartid-385649-18193413.pdf?src-supplier=Verical; ComponentLink1Description: https://datasheet.ciiva.com/18193/getdatasheetpartid-385649-18193413.pdf?src-supplier=Verical; ComponentLink2URL: https://datasheet.ciiva.com/7842/kem-c1002-x7r-smd-7842536.pdf?src-supplier=Element14; ComponentLink2Description: https://datasheet.ciiva.com/7842/kem-c1002-x7r-smd-7842536.pdf?src-supplier=Element14; ComponentLink3URL: https://datasheet.ciiva.com/7842/kem-c1002-x7r-smd-7842538.pdf?src-supplier=Element14; ComponentLink3Description: https://datasheet.ciiva.com/7842/kem-c1002-x7r-smd-7842538.pdf?src-supplier=Element14
F7 = 046701.5NR: 1.5A 0603 Fuse; Manufacturer_Name: LITTELFUSE; Datasheet Link: https://www.littelfuse.com/~/media/electronics/datasheets/fuses/littelfuse_fuse_467_datasheet.pdf.pdf; Height: 0.432mm; Manufacturer_Part_Number: 046701.5NR; Arrow Part Number: 046701.5NR; Arrow Price/Stock: https://www.arrow.com/en/products/046701.5nr/littelfuse; Mouser Part Number: 576-046701.5NR; Mouser Price/Stock: https://www.mouser.com/Search/Refine.aspx?Keyword=576-046701.5NR; Value: 1.5A
L1 = CMP-0220-00025-1: SMD EMI Suppression Ferrite Bead WE-CBF, Z = 300 Ohm; Impedance: 300 Ohm; ComponentLink1URL: http://www.we-online.com; PackageVersion: 2005; ComponentLink1Description: Manufacturer Link; ComponentLink2Description: Datasheet; DatasheetVersion: Dec-2005; ComponentLink2URL: http://www.we-online.de/katalog/media/pdf/742792031.pdf; PackageReference: SMD-0805; PackageDescription: Chip Inductor, 2-Leads, Body 2.0 x 1.2 mm
LED2 = CMP-62016-000032-1: as LED1 on sheet Sensors; Depth: 1.35mm; Min Operating Temperature: -30°C; Length: 2.1mm; Max Operating Temperature: 85°C; Radiation Hardening: No; Packaging: Tape and Reel; Number of Pins: 2; Mount: Surface Mount; Lens Style: Diffused
LED3 = CMP-1426-00008-1: SMD mono-color Chip LED, WL-SMCW, Blue; Manufacturer: Wuerth Elektronik; Color: Blue; ComponentLink2URL: http://katalog.we-online.com/led/datasheet/150080BS75000.pdf; ComponentLink1URL: http://www.we-online.com; ComponentLink2Description: Datasheet; PackageReference: 0805_A; ComponentLink1Description: Manufacturer URL; PartNumber: 150080BS75000
LED4 = CMP-2000-05655-1: Single Color, 2 V, -30 to 85 degC, 2-Pin SMD (0805), RoHS, Tape and Reel; Manufacturer: Dialight; Main Category: ChipLED; Shape Type: Rectangular; Forward Current: 25mA; Product Length (mm): 2mm; Emitting Color: YellowGreen; Test Current (It): 20mA; Number of  Elements: 1; Luminous Intensity: 20mcd; DELETED: Compliant; Reverse Voltage: 5V; Chip Material: GaP; High Brightness: No; Viewing Angle: 140deg; Dominant Wave Length: 570nm; Type: Uni-Color; Product Depth (mm): 1.25mm; Power Dissipation: 60W; Product Height (mm): 0.7mm; Forward Voltage: 2.4V; Lens Dimensions: 1.4x1.25x0.4mm; Pin Count: 2; Datasheet URL: https://datasheet.ciiva.com/22748/1484480-22748121.pdf; Operating Temperature Classification: Commercial; Package Reference: 0805; Operating Temp Range: -30Cto85C; Mounting: SurfaceMount; Mounting Technology: SurfaceMount; Manufacturer URL: http://www.dialight.com/; Package Description: 2-Pin Surface Mount Device, Body 2 x 1.25 mm; Lum Intensity: 20mcd; Datasheet Version: 10/2008; Rad Hardened: No; Packaging: TapeandReel; Package Type: SMD
P1 = BEI15-050-Q12N-C: DC Converter 2 Output 5V -5V 1.5A, 1.5A 9V - 36V Input; Manufacturer: Murata; Datasheet: https://www.murata.com/products/productdata/8807024656414/bei15.pdf?1583754810000; Model: BEI15-050-Q12N-C; Digi-Key Part Number: 811-2180-5-ND
R44 = CMP-009-00001-4: Chip Resistor, 1k Ohm, +/- 1%, 125 mW, -55 to 155 degC, 0805 (2012 Metric); Manufacturer: Panasonic; Manufacturer Part Number: ERA-6AEB102V; Resistance: 1kR; Tolerance: 0.1%; Temperature Coefficient: 25ppm/°C; Voltage Rating: 100V; Power Rating: 125mW; Value: 1k; Supplier 1: Digi-Key; Supplier Part Number 1: P1.0KDACT-ND; RoHS: Yes; Category: Chip SMD Resistors; Stock 1: 122815; Pricing 1: 1=0.33000, 10=0.27800, 100=0.10850, 1000=0.04541, 2500=0.04163 (USD); Mount: Surface Mount; Case/Package: 0805; Number of Pins: 2; Contact Plating: Tin; Case Code (Metric): 2012; Case Code (Imperial): 0805; Min Operating Temperature: -55°C; Max Operating Temperature: 155°C; Composition: Thin Film; Packaging: Tape and Reel; Package Quantity: 5000; Number of Terminations: 2; Military Standard: Not; Termination: SMD/SMT; Max Power Dissipation: 125mW; Working Voltage: 100V; Length: 2mm; Height: 0.5mm; Width: 1.25mm; Depth: 1.25mm; Radiation Hardening: No; REACH SVHC: No SVHC; ComponentLink1URL: https://datasheet.ciiva.com/11811/0900766b80beefcc-11811155.pdf?src-supplier=RSComponents; ComponentLink1Description: https://datasheet.ciiva.com/11811/0900766b80beefcc-11811155.pdf?src-supplier=RSComponents; ComponentLink2URL: https://datasheet.ciiva.com/29184/453027-da-01-en-widerstand-0805-era-29184108.pdf?src-supplier=Conrad; ComponentLink2Description: https://datasheet.ciiva.com/29184/453027-da-01-en-widerstand-0805-era-29184108.pdf?src-supplier=Conrad; ComponentLink3URL: https://datasheet.ciiva.com/30057/54aoa0000ce26-30057591.pdf?src-supplier=Onlinecomponents.com; ComponentLink3Description: https://datasheet.ciiva.com/30057/54aoa0000ce26-30057591.pdf?src-supplier=Onlinecomponents.com; ComponentLink4URL: https://datasheet.ciiva.com/48536/era-eng-tds-48536727.pdf?src-supplier=Distrelec; ComponentLink4Description: https://datasheet.ciiva.com/48536/era-eng-tds-48536727.pdf?src-supplier=Distrelec; ComponentLink5URL: https://datasheet.ciiva.com/9198/aoa0000ce26-9198984.pdf?src-supplier=Avnet; ComponentLink5Description: https://datasheet.ciiva.com/9198/aoa0000ce26-9198984.pdf?src-supplier=Avnet; ComponentLink6URL: https://datasheet.ciiva.com/16782/70068849-16782808.pdf?src-supplier=Allied+Electronics; ComponentLink6Description: https://datasheet.ciiva.com/16782/70068849-16782808.pdf?src-supplier=Allied+Electronics; ComponentLink7URL: https://datasheet.ciiva.com/24025/aoa0000ce26-197354-24025849.pdf?src-supplier=Mouser; ComponentLink7Description: https://datasheet.ciiva.com/24025/aoa0000ce26-197354-24025849.pdf?src-supplier=Mouser; ComponentLink8URL: https://datasheet.ciiva.com/43455/485442-43455257.pdf?src-supplier=Farnell; ComponentLink8Description: https://datasheet.ciiva.com/43455/485442-43455257.pdf?src-supplier=Farnell; ComponentLink9URL: https://datasheet.ciiva.com/43457/485442-43457803.pdf?src-supplier=Farnell; ComponentLink9Description: https://datasheet.ciiva.com/43457/485442-43457803.pdf?src-supplier=Farnell; ComponentLink10URL: https://datasheet.ciiva.com/7942/485442-7942414.pdf?src-supplier=Element14; ComponentLink10Description: https://datasheet.ciiva.com/7942/485442-7942414.pdf?src-supplier=Element14; ComponentLink11URL: https://datasheet.ciiva.com/16201/aoa0000ce26-16201486.pdf?src-supplier=Future+Electronics; ComponentLink11Description: https://datasheet.ciiva.com/16201/aoa0000ce26-16201486.pdf?src-supplier=Future+Electronics; ComponentLink12URL: https://datasheet.ciiva.com/22783/485442-22783806.pdf?src-supplier=Farnell; ComponentLink12Description: https://datasheet.ciiva.com/22783/485442-22783806.pdf?src-supplier=Farnell; ComponentLink13URL: https://datasheet.ciiva.com/7942/485442-7942415.pdf?src-supplier=Element14; ComponentLink13Description: https://datasheet.ciiva.com/7942/485442-7942415.pdf?src-supplier=Element14
R45 = CMP-009-00001-4: Chip Resistor, 100 Ohm, +/- 1%, 125 mW, -55 to 155 degC, 0805 (2012 Metric); Manufacturer: Panasonic; Manufacturer Part Number: ERA-6AEB101V; Tolerance: 0.1%; Resistance: 100R; Temperature Coefficient: 25ppm/°C; Power Rating: 125mW; Voltage Rating: 100V; Value: 100; Supplier 1: Digi-Key; Supplier Part Number 1: P100DACT-ND; RoHS: Yes; Category: Chip SMD Resistors; Stock 1: 127229; Pricing 1: 1=0.33000, 10=0.27800, 100=0.10850, 1000=0.04541, 2500=0.04163 (USD); Mount: Surface Mount; Case/Package: 0805; Number of Pins: 2; Contact Plating: Tin; Case Code (Imperial): 0805; Case Code (Metric): 2012; Min Operating Temperature: -55°C; Max Operating Temperature: 155°C; Composition: Metal Film,Thin Film; Packaging: Tape and Reel; Package Quantity: 1; Termination: SMD/SMT; Number of Terminations: 2; Military Standard: Not; Max Power Dissipation: 125mW; Voltage Rating (DC): 100V; Features: Automotive AEC-Q200; Length: 2mm; Height: 0.5mm; Width: 1.25mm; Depth: 1.25mm; Radiation Hardening: No; REACH SVHC: No SVHC; Lead Free: Lead Free; ComponentLink1URL: https://datasheet.ciiva.com/11810/0900766b80beefcc-11810733.pdf?src-supplier=RSComponents; ComponentLink1Description: https://datasheet.ciiva.com/11810/0900766b80beefcc-11810733.pdf?src-supplier=RSComponents; ComponentLink2URL: https://datasheet.ciiva.com/29184/452698-da-01-en-widerstand-0805-era-29184051.pdf?src-supplier=Conrad; ComponentLink2Description: https://datasheet.ciiva.com/29184/452698-da-01-en-widerstand-0805-era-29184051.pdf?src-supplier=Conrad; ComponentLink3URL: https://datasheet.ciiva.com/16774/70068849-16774677.pdf?src-supplier=Allied+Electronics; ComponentLink3Description: https://datasheet.ciiva.com/16774/70068849-16774677.pdf?src-supplier=Allied+Electronics; ComponentLink4URL: https://datasheet.ciiva.com/22758/485442-22758149.pdf?src-supplier=Farnell; ComponentLink4Description: https://datasheet.ciiva.com/22758/485442-22758149.pdf?src-supplier=Farnell; ComponentLink5URL: https://datasheet.ciiva.com/46438/485442-46438213.pdf?src-supplier=Element14; ComponentLink5Description: https://datasheet.ciiva.com/46438/485442-46438213.pdf?src-supplier=Element14; ComponentLink6URL: https://datasheet.ciiva.com/16770/70068849-16770007.pdf?src-supplier=Allied+Electronics; ComponentLink6Description: https://datasheet.ciiva.com/16770/70068849-16770007.pdf?src-supplier=Allied+Electronics; ComponentLink7URL: https://datasheet.ciiva.com/46438/485442-46438214.pdf?src-supplier=Element14; ComponentLink7Description: https://datasheet.ciiva.com/46438/485442-46438214.pdf?src-supplier=Element14; ComponentLink8URL: https://datasheet.ciiva.com/30140/54aoa0000ce26-30140696.pdf?src-supplier=Onlinecomponents.com; ComponentLink8Description: https://datasheet.ciiva.com/30140/54aoa0000ce26-30140696.pdf?src-supplier=Onlinecomponents.com; ComponentLink9URL: https://datasheet.ciiva.com/17207/aoa0000ce26-17207961.pdf?src-supplier=Avnet+Europe; ComponentLink9Description: https://datasheet.ciiva.com/17207/aoa0000ce26-17207961.pdf?src-supplier=Avnet+Europe; ComponentLink10URL: https://datasheet.ciiva.com/24072/aoa0000ce26-32660-24072217.pdf?src-supplier=Mouser; ComponentLink10Description: https://datasheet.ciiva.com/24072/aoa0000ce26-32660-24072217.pdf?src-supplier=Mouser; ComponentLink11URL: https://datasheet.ciiva.com/28513/485442-28513850.pdf?src-supplier=Element14; ComponentLink11Description: https://datasheet.ciiva.com/28513/485442-28513850.pdf?src-supplier=Element14; ComponentLink12URL: https://datasheet.ciiva.com/48536/era-eng-tds-48536747.pdf?src-supplier=Distrelec; ComponentLink12Description: https://datasheet.ciiva.com/48536/era-eng-tds-48536747.pdf?src-supplier=Distrelec; ComponentLink13URL: https://datasheet.ciiva.com/16396/aoa0000ce26-16396828.pdf?src-supplier=Future+Electronics; ComponentLink13Description: https://datasheet.ciiva.com/16396/aoa0000ce26-16396828.pdf?src-supplier=Future+Electronics; ComponentLink14URL: https://datasheet.ciiva.com/9186/aoa0000ce26-9186749.pdf?src-supplier=Avnet; ComponentLink14Description: https://datasheet.ciiva.com/9186/aoa0000ce26-9186749.pdf?src-supplier=Avnet
R46 = CMP-009-00001-4: Chip Resistor, 75 Ohm, +/- 1%, 125 mW, -55 to 155 degC, 0805 (2012 Metric); Manufacturer: Panasonic; Manufacturer Part Number: ERA-6AEB750V; Resistance: 75R; Tolerance: 0.1%; Temperature Coefficient: 25ppm/°C; Power Rating: 125mW; Voltage Rating: 100V; Value: 75; Supplier 1: Digi-Key; Supplier Part Number 1: P75DACT-ND; RoHS: Yes; Category: Chip SMD Resistors; Stock 1: 28530; Pricing 1: 1=0.33000, 10=0.27800, 100=0.10850, 1000=0.04541, 2500=0.04163 (USD); Mount: Surface Mount; Case/Package: 0805; Number of Pins: 2; Contact Plating: Tin; Case Code (Metric): 2012; Case Code (Imperial): 0805; Min Operating Temperature: -55°C; Max Operating Temperature: 155°C; Composition: Thin Film; Packaging: Tape and Reel; Package Quantity: 5000; Number of Terminations: 2; Termination: SMD/SMT; Military Standard: Not; Max Power Dissipation: 125mW; Voltage Rating (DC): 100V; Length: 2mm; Height: 0.024inch; Width: 0.049inch; Depth: 1.25mm; Radiation Hardening: No; REACH SVHC: Yes; Lead Free: Lead Free; ComponentLink1URL: https://datasheet.ciiva.com/29184/452659-da-01-en-widerstand-0805-era-29184043.pdf?src-supplier=Conrad; ComponentLink1Description: https://datasheet.ciiva.com/29184/452659-da-01-en-widerstand-0805-era-29184043.pdf?src-supplier=Conrad; ComponentLink2URL: https://datasheet.ciiva.com/5917/485442-5917734.pdf?src-supplier=Farnell; ComponentLink2Description: https://datasheet.ciiva.com/5917/485442-5917734.pdf?src-supplier=Farnell; ComponentLink3URL: https://datasheet.ciiva.com/48536/era-eng-tds-48536758.pdf?src-supplier=Distrelec; ComponentLink3Description: https://datasheet.ciiva.com/48536/era-eng-tds-48536758.pdf?src-supplier=Distrelec; ComponentLink4URL: https://datasheet.ciiva.com/5917/485442-5917735.pdf?src-supplier=Farnell; ComponentLink4Description: https://datasheet.ciiva.com/5917/485442-5917735.pdf?src-supplier=Farnell; ComponentLink5URL: https://datasheet.ciiva.com/5917/485442-5917736.pdf?src-supplier=Farnell; ComponentLink5Description: https://datasheet.ciiva.com/5917/485442-5917736.pdf?src-supplier=Farnell; ComponentLink6URL: https://datasheet.ciiva.com/7710/485442-7710664.pdf?src-supplier=Element14; ComponentLink6Description: https://datasheet.ciiva.com/7710/485442-7710664.pdf?src-supplier=Element14; ComponentLink7URL: https://datasheet.ciiva.com/17208/aoa0000ce26-17208633.pdf?src-supplier=Avnet+Europe; ComponentLink7Description: https://datasheet.ciiva.com/17208/aoa0000ce26-17208633.pdf?src-supplier=Avnet+Europe; ComponentLink8URL: https://datasheet.ciiva.com/48425/era-eng-tds-48425627.pdf?src-supplier=Distrelec; ComponentLink8Description: https://datasheet.ciiva.com/48425/era-eng-tds-48425627.pdf?src-supplier=Distrelec; ComponentLink9URL: https://datasheet.ciiva.com/30147/54aoa0000ce26-30147167.pdf?src-supplier=Onlinecomponents.com; ComponentLink9Description: https://datasheet.ciiva.com/30147/54aoa0000ce26-30147167.pdf?src-supplier=Onlinecomponents.com; ComponentLink10URL: https://datasheet.ciiva.com/7710/485442-7710665.pdf?src-supplier=Element14; ComponentLink10Description: https://datasheet.ciiva.com/7710/485442-7710665.pdf?src-supplier=Element14; ComponentLink11URL: https://datasheet.ciiva.com/9187/aoa0000ce26-9187722.pdf?src-supplier=Avnet; ComponentLink11Description: https://datasheet.ciiva.com/9187/aoa0000ce26-9187722.pdf?src-supplier=Avnet
U15 = CMP-12756-000039-1: IC REG LINEAR 3.3V 1A SOT223; Operating Supply Current: 3.5mA; Polarity: Positive; Reference Voltage: 1.262V; Max Input Voltage: 13V; Accuracy: 1%; Power Supply Rejection Ratio (PSRR): 70dB; Number of Regulators: 1; Dropout Voltage: 1.1V; Output Type: Fixed; Output Voltage: 3.3V; Package Quantity: 4000; Lead Free: Lead Free; Number of Pins: 3; Output Current: 1A; Packaging: Tape and Reel; Min Operating Temperature: -40°C; Max Operating Temperature: 125°C; Quiescent Current: 3.5mA; Contact Plating: Tin; Case/Package: TO-261-4; Weight: 0.000282oz; Mount: Surface Mount; Number of Outputs: 1; Max Output Current: 1A